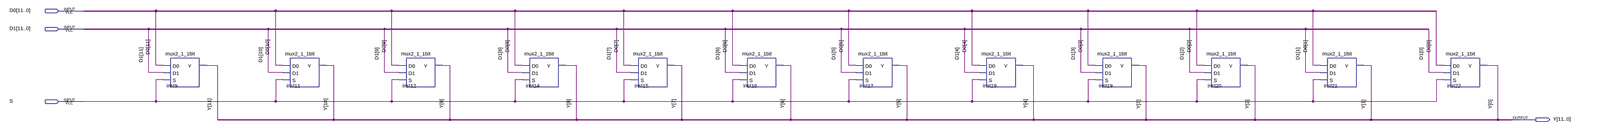
[diagram p0: schematic sheet, whole]
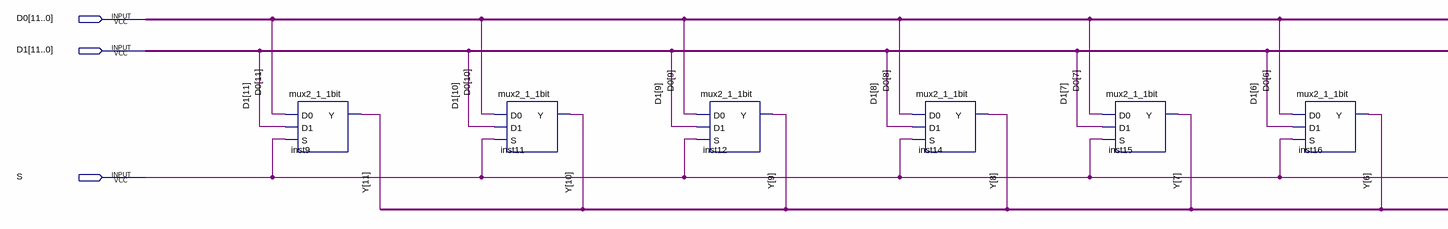
[diagram p1: schematic sheet, left part]
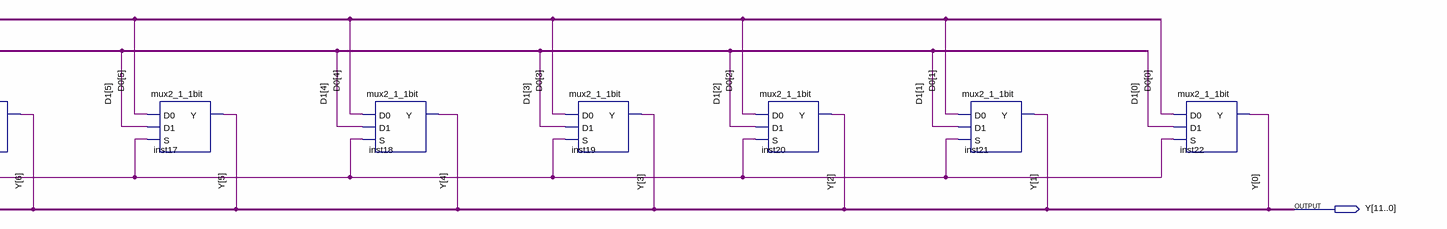
[diagram p2: schematic sheet, right part]
// Quartus schematic mux2_1_12bit.bdf as structural Verilog: 12 symbols, 4 pins
module mux2_1_12bit (
  input  [11:0] D0,
  input  [11:0] D1,
  input  S,
  output [11:0] Y
);

  mux2_1_1bit inst9 (.D0(D0[11]), .D1(D1[11]), .S(S), .Y(Y[11]));
  mux2_1_1bit inst11 (.D0(D0[10]), .D1(D1[10]), .S(S), .Y(Y[10]));
  mux2_1_1bit inst12 (.D0(D0[9]), .D1(D1[9]), .S(S), .Y(Y[9]));
  mux2_1_1bit inst14 (.D0(D0[8]), .D1(D1[8]), .S(S), .Y(Y[8]));
  mux2_1_1bit inst15 (.D0(D0[7]), .D1(D1[7]), .S(S), .Y(Y[7]));
  mux2_1_1bit inst16 (.D0(D0[6]), .D1(D1[6]), .S(S), .Y(Y[6]));
  mux2_1_1bit inst17 (.D0(D0[5]), .D1(D1[5]), .S(S), .Y(Y[5]));
  mux2_1_1bit inst18 (.D0(D0[4]), .D1(D1[4]), .S(S), .Y(Y[4]));
  mux2_1_1bit inst19 (.D0(D0[3]), .D1(D1[3]), .S(S), .Y(Y[3]));
  mux2_1_1bit inst20 (.D0(D0[2]), .D1(D1[2]), .S(S), .Y(Y[2]));
  mux2_1_1bit inst21 (.D0(D0[1]), .D1(D1[1]), .S(S), .Y(Y[1]));
  mux2_1_1bit inst22 (.D0(D0[0]), .D1(D1[0]), .S(S), .Y(Y[0]));
endmodule
